# Altium project 40%_ws2812.PrjPcb
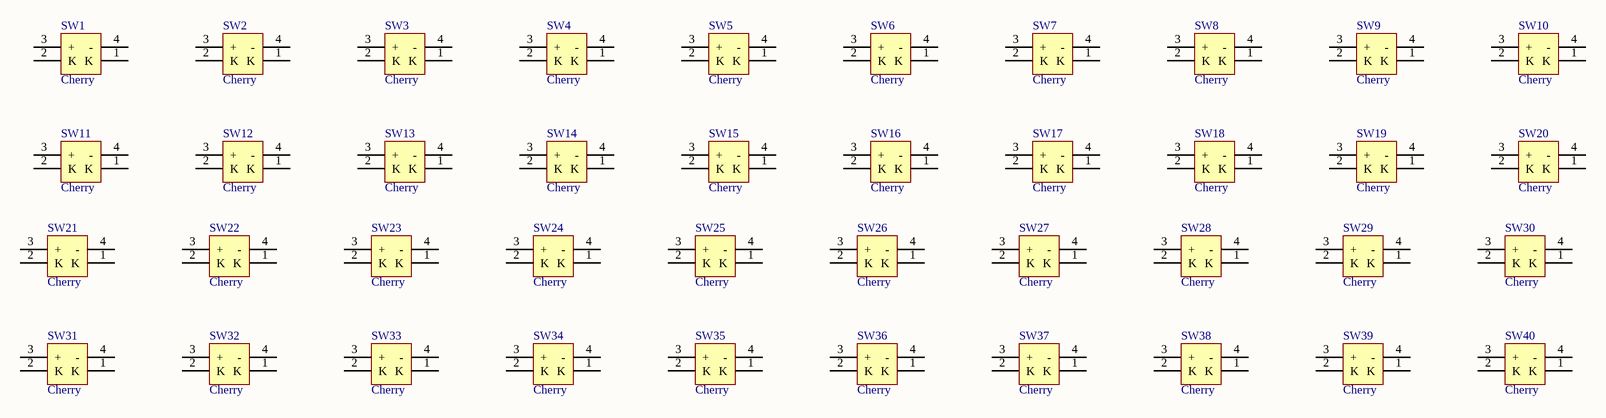
[diagram p0: Sheet1.SchDoc]
1 sheet, 40 parts. Net scope: global (net labels, ports and power ports of the same name join across sheets).
Board file: 40%_ws2812.PcbDoc

## Sheet Sheet1.SchDoc
size A4; SheetNumber: 1; SheetTotal: 1

### Parts
SW1  Cherry  [SW_Cherry_MX_WS2812]
SW2  Cherry  [SW_Cherry_MX_WS2812]
SW3  Cherry  [SW_Cherry_MX_WS2812]
SW4  Cherry  [SW_Cherry_MX_WS2812]
SW5  Cherry  [SW_Cherry_MX_WS2812]
SW6  Cherry  [SW_Cherry_MX_WS2812]
SW7  Cherry  [SW_Cherry_MX_WS2812]
SW8  Cherry  [SW_Cherry_MX_WS2812]
SW9  Cherry  [SW_Cherry_MX_WS2812]
SW10  Cherry  [SW_Cherry_MX_WS2812]
SW11  Cherry  [SW_Cherry_MX_WS2812]
SW12  Cherry  [SW_Cherry_MX_WS2812]
SW13  Cherry  [SW_Cherry_MX_WS2812]
SW14  Cherry  [SW_Cherry_MX_WS2812]
SW15  Cherry  [SW_Cherry_MX_WS2812]
SW16  Cherry  [SW_Cherry_MX_WS2812]
SW17  Cherry  [SW_Cherry_MX_WS2812]
SW18  Cherry  [SW_Cherry_MX_WS2812]
SW19  Cherry  [SW_Cherry_MX_WS2812]
SW20  Cherry  [SW_Cherry_MX_WS2812]
SW21  Cherry  [SW_Cherry_MX_WS2812]
SW22  Cherry  [SW_Cherry_MX_WS2812]
SW23  Cherry  [SW_Cherry_MX_WS2812]
SW24  Cherry  [SW_Cherry_MX_WS2812]
SW25  Cherry  [SW_Cherry_MX_WS2812]
SW26  Cherry  [SW_Cherry_MX_WS2812]
SW27  Cherry  [SW_Cherry_MX_WS2812]
SW28  Cherry  [SW_Cherry_MX_WS2812]
SW29  Cherry  [SW_Cherry_MX_WS2812]
SW30  Cherry  [SW_Cherry_MX_WS2812]
SW31  Cherry  [SW_Cherry_MX_WS2812]
SW32  Cherry  [SW_Cherry_MX_WS2812]
SW33  Cherry  [SW_Cherry_MX_WS2812]
SW34  Cherry  [SW_Cherry_MX_WS2812]
SW35  Cherry  [SW_Cherry_MX_WS2812]
SW36  Cherry  [SW_Cherry_MX_WS2812]
SW37  Cherry  [SW_Cherry_MX_WS2812]
SW38  Cherry  [SW_Cherry_MX_WS2812]
SW39  Cherry  [SW_Cherry_MX_WS2812]
SW40  Cherry  [SW_Cherry_MX_WS2812]

### Nets

Not connected (* = marked no-connect by the designer): SW1 1(K) 2(K) 3(+) 4(-); SW2 1(K) 2(K) 3(+) 4(-); SW3 1(K) 2(K) 3(+) 4(-); SW4 1(K) 2(K) 3(+) 4(-); SW5 1(K) 2(K) 3(+) 4(-); SW6 1(K) 2(K) 3(+) 4(-); SW7 1(K) 2(K) 3(+) 4(-); SW8 1(K) 2(K) 3(+) 4(-); SW9 1(K) 2(K) 3(+) 4(-); SW10 1(K) 2(K) 3(+) 4(-); SW11 1(K) 2(K) 3(+) 4(-); SW12 1(K) 2(K) 3(+) 4(-); SW13 1(K) 2(K) 3(+) 4(-); SW14 1(K) 2(K) 3(+) 4(-); SW15 1(K) 2(K) 3(+) 4(-); SW16 1(K) 2(K) 3(+) 4(-); SW17 1(K) 2(K) 3(+) 4(-); SW18 1(K) 2(K) 3(+) 4(-); SW19 1(K) 2(K) 3(+) 4(-); SW20 1(K) 2(K) 3(+) 4(-); SW21 1(K) 2(K) 3(+) 4(-); SW22 1(K) 2(K) 3(+) 4(-); SW23 1(K) 2(K) 3(+) 4(-); SW24 1(K) 2(K) 3(+) 4(-); SW25 1(K) 2(K) 3(+) 4(-); SW26 1(K) 2(K) 3(+) 4(-); SW27 1(K) 2(K) 3(+) 4(-); SW28 1(K) 2(K) 3(+) 4(-); SW29 1(K) 2(K) 3(+) 4(-); SW30 1(K) 2(K) 3(+) 4(-); SW31 1(K) 2(K) 3(+) 4(-); SW32 1(K) 2(K) 3(+) 4(-); SW33 1(K) 2(K) 3(+) 4(-); SW34 1(K) 2(K) 3(+) 4(-); SW35 1(K) 2(K) 3(+) 4(-); SW36 1(K) 2(K) 3(+) 4(-); SW37 1(K) 2(K) 3(+) 4(-); SW38 1(K) 2(K) 3(+) 4(-); SW39 1(K) 2(K) 3(+) 4(-); SW40 1(K) 2(K) 3(+) 4(-)

### Library data of the parts
SW1-SW40 = LSW: 带灯机械按键开关; 版权归属: 源创客; BOM名称: 带灯机械按键开关; 学习资源: www.ooocke.com